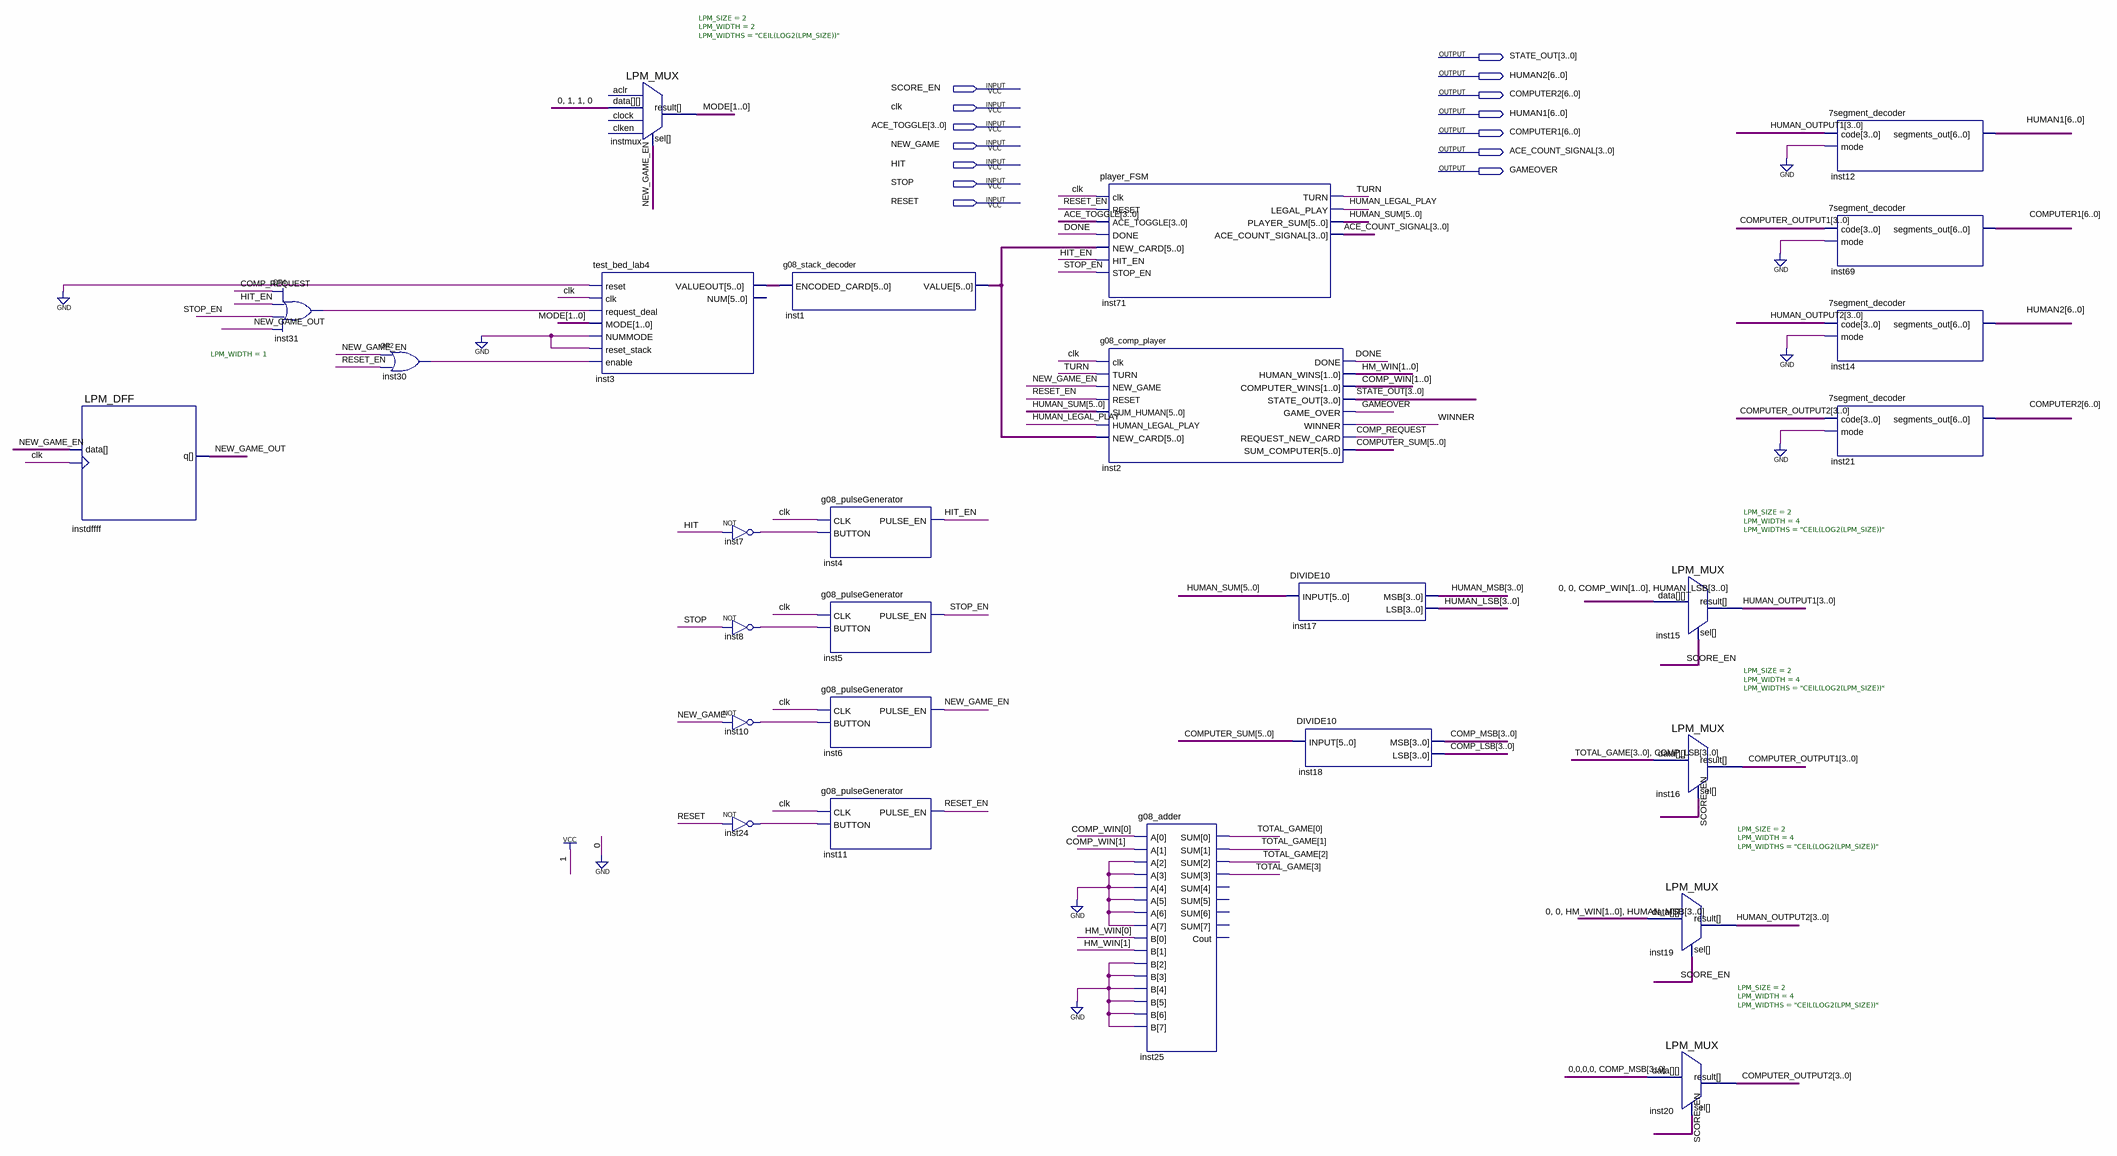
[diagram p0: schematic sheet]
// Quartus schematic test_bed.bdf as structural Verilog: 27 symbols, 14 pins
module test_bed (
  input  SCORE_EN,
  input  clk,
  input  [3:0] ACE_TOGGLE,
  input  NEW_GAME,
  input  HIT,
  input  STOP,
  input  RESET,
  output [3:0] STATE_OUT,
  output [6:0] HUMAN2,
  output [6:0] COMPUTER2,
  output [6:0] HUMAN1,
  output [6:0] COMPUTER1,
  output [3:0] ACE_COUNT_SIGNAL,
  output GAMEOVER
);

  wire COMP_REQUEST, DONE, HIT_EN, HUMAN_LEGAL_PLAY, inst7_out, inst8_out, inst10_out, inst24_out,
       inst30_out, inst31_out, NEW_GAME_EN, NEW_GAME_OUT, RESET_EN, STOP_EN, TURN, WINNER;
  wire [1:0] COMP_WIN, HM_WIN, MODE;
  wire [3:0] COMP_LSB, COMP_MSB, COMPUTER_OUTPUT1, COMPUTER_OUTPUT2, HUMAN_LSB, HUMAN_MSB, HUMAN_OUTPUT1,
       HUMAN_OUTPUT2, TOTAL_GAME;
  wire [5:0] COMPUTER_SUM, HUMAN_SUM, inst1_value, inst3_valueout;
  wire [7:0] inst25_sum_open;  // unused outputs

  LPM_DFF #(.LPM_WIDTH(1)) instdffff (.clock(clk), .data(NEW_GAME_EN), .q(NEW_GAME_OUT));
  or inst31 (inst31_out, COMP_REQUEST, HIT_EN, STOP_EN, NEW_GAME_OUT);
  or inst30 (inst30_out, NEW_GAME_EN, RESET_EN);
  test_bed_lab4 inst3 (
    .reset(1'b0), .clk(clk), .request_deal(inst31_out), .MODE(MODE), .NUMMODE(1'b0), .reset_stack(1'b0),
    .enable(inst30_out), .VALUEOUT(inst3_valueout));  // open: NUM
  LPM_MUX #(.LPM_SIZE(2), .LPM_WIDTH(2), .LPM_WIDTHS("CEIL(LOG2(LPM_SIZE))")) instmux (
    .data(4'b0110), .sel(NEW_GAME_EN), .result(MODE));  // open: clock, aclr, clken
  not inst7 (inst7_out, HIT);
  not inst8 (inst8_out, STOP);
  not inst10 (inst10_out, NEW_GAME);
  not inst24 (inst24_out, RESET);
  g08_stack_decoder inst1 (.ENCODED_CARD(inst3_valueout), .VALUE(inst1_value));
  g08_pulseGenerator inst4 (.CLK(clk), .BUTTON(inst7_out), .PULSE_EN(HIT_EN));
  g08_pulseGenerator inst5 (.CLK(clk), .BUTTON(inst8_out), .PULSE_EN(STOP_EN));
  g08_pulseGenerator inst6 (.CLK(clk), .BUTTON(inst10_out), .PULSE_EN(NEW_GAME_EN));
  g08_pulseGenerator inst11 (.CLK(clk), .BUTTON(inst24_out), .PULSE_EN(RESET_EN));
  player_FSM inst71 (
    .clk(clk), .RESET(RESET_EN), .ACE_TOGGLE(ACE_TOGGLE), .DONE(DONE), .NEW_CARD(inst1_value),
    .HIT_EN(HIT_EN), .STOP_EN(STOP_EN), .TURN(TURN), .LEGAL_PLAY(HUMAN_LEGAL_PLAY), .PLAYER_SUM(HUMAN_SUM),
    .ACE_COUNT_SIGNAL(ACE_COUNT_SIGNAL));
  g08_comp_player inst2 (
    .clk(clk), .TURN(TURN), .NEW_GAME(NEW_GAME_EN), .RESET(RESET_EN), .SUM_HUMAN(HUMAN_SUM),
    .HUMAN_LEGAL_PLAY(HUMAN_LEGAL_PLAY), .NEW_CARD(inst1_value), .DONE(DONE), .HUMAN_WINS(HM_WIN),
    .COMPUTER_WINS(COMP_WIN), .STATE_OUT(STATE_OUT), .GAME_OVER(GAMEOVER), .WINNER(WINNER),
    .REQUEST_NEW_CARD(COMP_REQUEST), .SUM_COMPUTER(COMPUTER_SUM));
  g08_adder inst25 (
    .A({{6{1'b0}}, COMP_WIN}), .B({{6{1'b0}}, HM_WIN}), .SUM({inst25_sum_open[7:4], TOTAL_GAME}));  // open: Cout
  DIVIDE10 inst17 (.INPUT(HUMAN_SUM), .MSB(HUMAN_MSB), .LSB(HUMAN_LSB));
  DIVIDE10 inst18 (.INPUT(COMPUTER_SUM), .MSB(COMP_MSB), .LSB(COMP_LSB));
  LPM_MUX #(.LPM_SIZE(2), .LPM_WIDTH(4), .LPM_WIDTHS("CEIL(LOG2(LPM_SIZE))")) inst15 (
    .data({2'b00, COMP_WIN, HUMAN_LSB}), .sel(SCORE_EN), .result(HUMAN_OUTPUT1));
  LPM_MUX #(.LPM_SIZE(2), .LPM_WIDTH(4), .LPM_WIDTHS("CEIL(LOG2(LPM_SIZE))")) inst16 (
    .data({TOTAL_GAME, COMP_LSB}), .sel(SCORE_EN), .result(COMPUTER_OUTPUT1));
  LPM_MUX #(.LPM_SIZE(2), .LPM_WIDTH(4), .LPM_WIDTHS("CEIL(LOG2(LPM_SIZE))")) inst19 (
    .data({2'b00, HM_WIN, HUMAN_MSB}), .sel(SCORE_EN), .result(HUMAN_OUTPUT2));
  LPM_MUX #(.LPM_SIZE(2), .LPM_WIDTH(4), .LPM_WIDTHS("CEIL(LOG2(LPM_SIZE))")) inst20 (
    .data({4'b0000, COMP_MSB}), .sel(SCORE_EN), .result(COMPUTER_OUTPUT2));
  \7segment_decoder  inst12 (.code(HUMAN_OUTPUT1), .mode(1'b0), .segments_out(HUMAN1));
  \7segment_decoder  inst69 (.code(COMPUTER_OUTPUT1), .mode(1'b0), .segments_out(COMPUTER1));
  \7segment_decoder  inst14 (.code(HUMAN_OUTPUT2), .mode(1'b0), .segments_out(HUMAN2));
  \7segment_decoder  inst21 (.code(COMPUTER_OUTPUT2), .mode(1'b0), .segments_out(COMPUTER2));
endmodule
